# EasyEDA Pro project 数控电源_V3.eprj, board PCB10
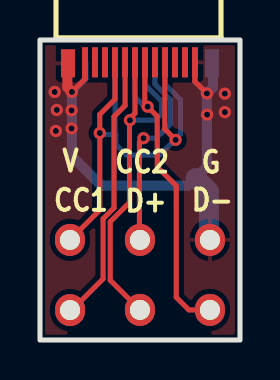
[diagram p5: board, top side]
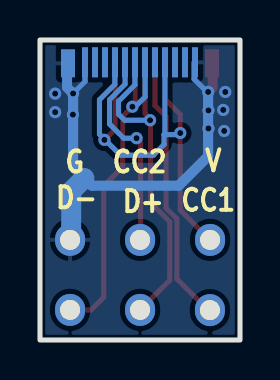
[diagram p6: board, bottom side, seen from below]

Outline 10 x 15 mm; copper layers: Top Layer, Bottom Layer. Coordinates in mm from the lower left corner of the outline.
Outline path: rectangle 0,15 10,0
Stack: Top Layer 0.035mm / Dielectric1 1.51mm FR4 er 4.5 / Bottom Layer 0.035mm

## Design rules (mm)
spacing copperThickness1oz (default): track to track 0.102, other pairs 0.152 to 0.3
spacing copperThickness2oz: track to track 0.203, other pairs 0.152 to 0.3
spacing Plane_innerPlane: track to track 0.102, other pairs 0.152 to 0.3
spacing Copper_copperRegion: track to track 0.102, other pairs 0.152 to 0.3
track width copperThickness1oz (default): min 0.127, default 0.254, max 2.54
track width copperThickness2oz: min 0.203, default 0.254, max 2.54
differential pair differentialPair (default): width min 0.127, default 0.254, max 2.54; gap min 0.152, default 0.152

## Placement (name value [footprint] x y rotation side)
H  1mm通孔  [DC-1-DIP]  1.5 5 0 top
H1  1mm通孔  [DC-1-DIP]  1.5 1.5 180 top
H2  1mm通孔  [DC-1-DIP]  5 1.5 0 top
H3  1mm通孔  [DC-1-DIP]  8.5 1.5 0 top
H4  1mm通孔  [DC-1-DIP]  5 5 0 top
H5  1mm通孔  [DC-1-DIP]  8.5 5 0 top
USB1  HX TYPE C-M 24P-RIV  [TYPE-C-SMD_TYPEC-PLUG-24PIN]  5 13.86 180 top

## Footprints (pads in the part's own frame, mm; a bottom-side part is the same pattern mirrored in y, then rotated)
DC-1-DIP
  oval 1.5x1.6 hole 1: 1(-0.004,0.004)
TYPE-C-SMD_TYPEC-PLUG-24PIN
  rect 0.7x1.4 smd far side: 25(-3.6,0.025)
  rect 0.7x1.4 smd: 25(3.6,0.025)
  rect 0.3x1.5 smd: A1(2.75,-0.025) A2(2.25,-0.025) A3(1.75,-0.025) A4(1.25,-0.025) A5(0.75,-0.025) A6(0.25,-0.025) A7(-0.25,-0.025) A8(-0.75,-0.025) A9(-1.25,-0.025) A10(-1.75,-0.025) A11(-2.25,-0.025) A12(-2.75,-0.025)
  rect 0.3x1.5 smd far side: B1(-2.75,-0.025) B2(-2.25,-0.025) B3(-1.75,-0.025) B4(-1.25,-0.025) B5(-0.75,-0.025) B6(-0.25,-0.025) B7(0.25,-0.025) B8(0.75,-0.025) B9(1.25,-0.025) B10(1.75,-0.025) B11(2.25,-0.025) B12(2.75,-0.025)

## Nets
As in the schematic.

Pads without a net: USB1 A2 A3 A8 A10 A11 B2 B3 B8 B10 B11

## Via types
v1: diameter 0.61, hole 0.305, Top Layer to Bottom Layer, 15 vias

## Routing (per net, layer and track width the routed paths; a pad name or vN(x,y) marks a point on that pad's centre or on a via; arc(x,y) is an arc through that point)
GND: length 28.3
  Top Layer w0.254: USB1.A1 2.26,13.87 2.26,13.07 v1(1.59,12.4) ; v1(8.35,12.33) 7.74,12.93 7.74,13.83
  Top Layer w0.5: v1(1.59,12.4) 1.37,12.63 1.37,13.76 1.45,13.83
  Bottom Layer w0.254: v1(8.35,12.33) 7.75,12.92 7.75,13.84 ; 2.3,13.88 2.3,13.04 1.67,12.41
  Bottom Layer w0.5: 8.65,13.83 8.65,12.63 v1(8.35,12.33)
  Bottom Layer w0.508: 7.78,8.1 7.4,7.72 3.07,7.72 1.59,9.19 v1(1.59,12.4) ; 7.78,8.1 8.35,8.66 v1(8.35,12.33) ; 7.78,8.1 7.78,8.17
  Bottom Layer w1: H5.1 8.44,5.06 8.44,7.44 7.78,8.1
  vias: v1(0.74,12.4) v1(0.84,11.5) v1(0.79,10.45) v1(1.58,11.48) v1(1.58,10.58) v1(8.35,11.27) v1(9.24,12.32) v1(9.24,11.39)
VCC: length 26.5
  Top Layer w0.254: 3.75,13.84 3.75,12.04 2.99,11.28 v1(2.99,10.35) 2.99,6.5 H.1 ; 6.22,13.81 6.24,13.79 6.24,10.55 v1(6.78,10.01)
  Bottom Layer w0.254: 3.8,10.27 3.76,10.31 3.76,13.84 ; 3.8,10.27 3.07,10.27 v1(2.99,10.35) ; 3.8,10.27 3.8,9.77 4.33,9.24 5.97,9.24 7.03,10.29 7.03,12.01 6.26,12.78 6.26,13.78 6.23,13.81
CC1: length 13.6
  Top Layer w0.254: 1.5,1.4 3.15,3.06 3.15,6.06 3.7,6.6 3.7,11.17 4.25,11.73 4.25,13.84
CC2: length 10.2
  Top Layer w0.254: v1(5.17,10.09) 4.97,9.89 4.97,5.03 H4.1
  Bottom Layer w0.254: 5.75,13.83 5.75,12.79 6.52,12.01 6.52,10.8 5.81,10.09 v1(5.17,10.09)
D+: length 18.1
  Top Layer w0.254: H2.1 3.51,2.99 3.51,5.91 4.47,6.88 4.47,11.06 4.75,11.34 4.75,13.84
  Bottom Layer w0.254: v1(4.5,10.99) 5.77,10.99 6.07,11.29 6.07,11.94 5.26,12.75 5.26,13.84
D-: length 16.8
  Top Layer w0.254: H3.1 7.44,1.5 6.81,2.14 6.81,7.71 5.87,8.65 5.86,11.19 v1(5.38,11.66) 5.38,11.73 5.24,11.87 5.24,13.83
  Bottom Layer w0.254: v1(5.38,11.66) 5.24,11.66 4.74,12.16 4.74,13.83

## Copper pours and planes (outline as drawn; the poured copper is in the pictures)
GND on Top Layer: 0.02,14.99 10.02,14.99 10.02,-0.01 0.02,-0.01
GND on Bottom Layer: 0.01,14.99 10.01,14.99 10.01,-0.01 0.01,-0.01

## Text on the board
Bottom Silkscreen Layer: V | CC1 | D+ | CC2 | G | D-
Document Layer: 0.8MM
Top Silkscreen Layer: CC1 | V | CC2 | D+ | D- | G
